# EAGLE design first schematic (EAGLE 7.6.0)
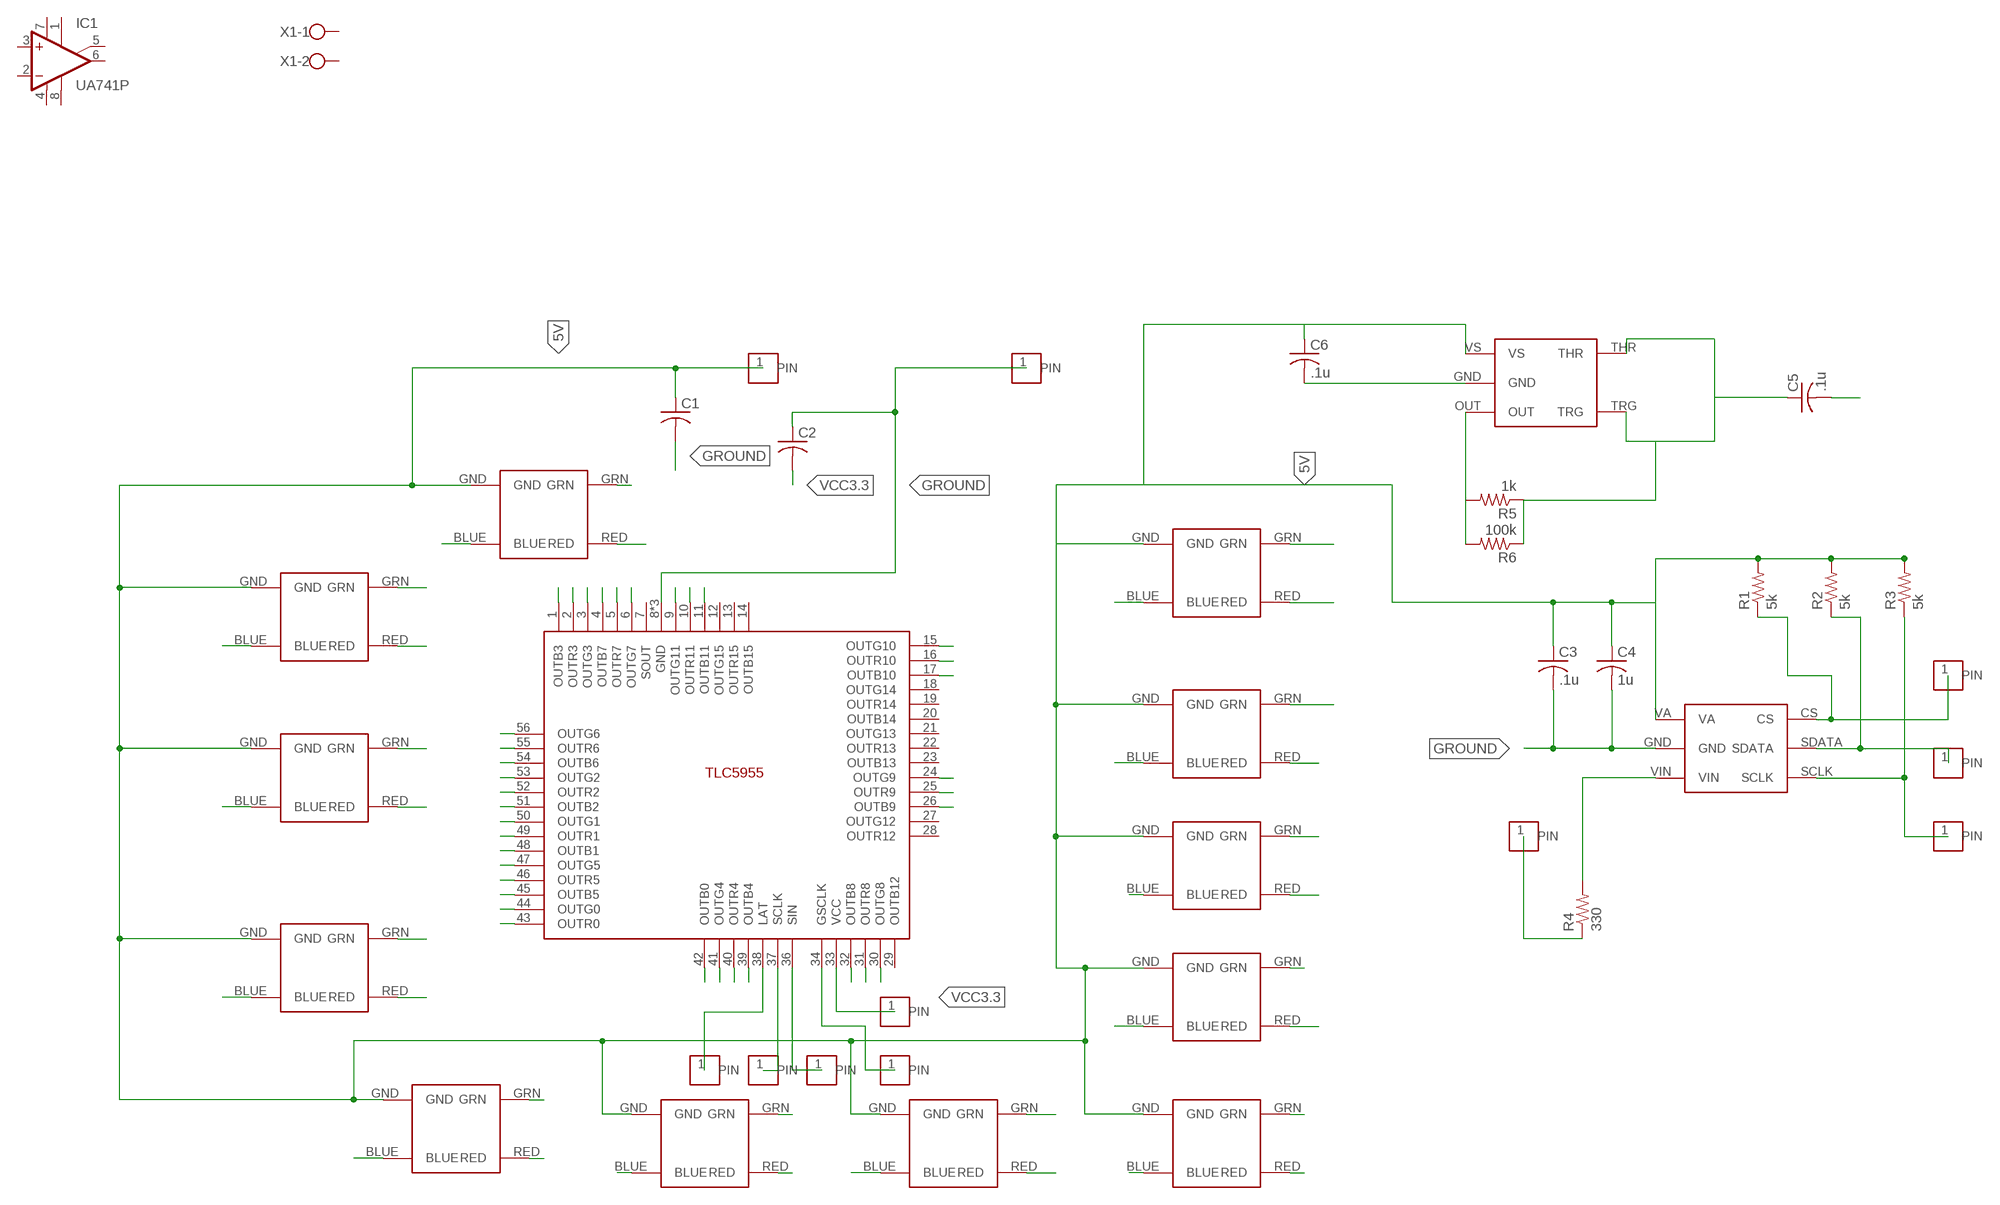
[diagram p0: schematic, sheet 1]

## Parts
3.3V  HEADERPIN_1  [HEADERPIN_1]
5V  HEADERPIN_1  [HEADERPIN_1]
C1  C-USC0805  [C0805]
C2  C-USC0805  [C0805]
C3  .1u  C-USC0805  [C0805]
C4  1u  C-USC0805  [C0805]
C5  .1u  C-USC0805  [C0805]
C6  .1u  C-USC0805  [C0805]
CS  HEADERPIN_1  [HEADERPIN_1]
GRND  HEADERPIN_1  [HEADERPIN_1]
GSCLK  HEADERPIN_1  [HEADERPIN_1]
IC1  UA741P  [DIL08]
LAT  HEADERPIN_1  [HEADERPIN_1]
R1  5k  R-US_M0805  [M0805]
R2  5k  R-US_M0805  [M0805]
R3  5k  R-US_M0805  [M0805]
R4  330  R-US_M0805  [M0805]
R5  1k  R-US_M0805  [M0805]
R6  100k  R-US_M0805  [M0805]
SCLK  HEADERPIN_1  [HEADERPIN_1]
SIN  HEADERPIN_1  [HEADERPIN_1]
SLK  HEADERPIN_1  [HEADERPIN_1]
TLC5955  TLC5954  [TLC5955]
TRG2  HEADERPIN_1  [HEADERPIN_1]
U$1  MIC1555  [SOT-23]
U$2  KINGSBRIGHT_LED_3.5X2.8  [KINGSBRIGHT_LED_3.5X2.8]
U$3  KINGSBRIGHT_LED_3.5X2.8  [KINGSBRIGHT_LED_3.5X2.8]
U$4  KINGSBRIGHT_LED_3.5X2.8  [KINGSBRIGHT_LED_3.5X2.8]
U$5  KINGSBRIGHT_LED_3.5X2.8  [KINGSBRIGHT_LED_3.5X2.8]
U$6  KINGSBRIGHT_LED_3.5X2.8  [KINGSBRIGHT_LED_3.5X2.8]
U$7  KINGSBRIGHT_LED_3.5X2.8  [KINGSBRIGHT_LED_3.5X2.8]
U$8  KINGSBRIGHT_LED_3.5X2.8  [KINGSBRIGHT_LED_3.5X2.8]
U$9  KINGSBRIGHT_LED_3.5X2.8  [KINGSBRIGHT_LED_3.5X2.8]
U$10  KINGSBRIGHT_LED_3.5X2.8  [KINGSBRIGHT_LED_3.5X2.8]
U$11  KINGSBRIGHT_LED_3.5X2.8  [KINGSBRIGHT_LED_3.5X2.8]
U$12  KINGSBRIGHT_LED_3.5X2.8  [KINGSBRIGHT_LED_3.5X2.8]
U$13  KINGSBRIGHT_LED_3.5X2.8  [KINGSBRIGHT_LED_3.5X2.8]
U$14  ADC121S101  [SOT-23(6)]
VIN  HEADERPIN_1  [HEADERPIN_1]
X1  W237-102  [W237-102]

## Nets
5V: 5V.1(PIN) C1.1 C3.1 C4.1 C6.1 R1.2 R2.2 R3.2 U$1.VS U$2.GND U$3.GND U$4.GND U$5.GND U$6.GND U$7.GND U$8.GND U$9.GND U$10.GND U$11.GND U$12.GND U$13.GND U$14.VA
B0: TLC5955.42(OUTB0) U$13.BLUE
B1: TLC5955.48(OUTB1) U$12.BLUE
B2: TLC5955.51(OUTB2) U$11.BLUE
B3: TLC5955.1(OUTB3) U$10.BLUE
B4: TLC5955.39(OUTB4) U$9.BLUE
B5: TLC5955.45(OUTB5) U$8.BLUE
B6: TLC5955.54(OUTB6) U$7.BLUE
B7: TLC5955.4(OUTB7) U$6.BLUE
B8: TLC5955.32(OUTB8) U$5.BLUE
B9: TLC5955.26(OUTB9) U$4.BLUE
B10: TLC5955.17(OUTB10) U$3.BLUE
B11: TLC5955.11(OUTB11) U$2.BLUE
G0: TLC5955.44(OUTG0) U$13.GRN
G1: TLC5955.50(OUTG1) U$12.GRN
G2: TLC5955.53(OUTG2) U$11.GRN
G3: TLC5955.3(OUTG3) U$10.GRN
G4: TLC5955.41(OUTG4) U$9.GRN
G5: TLC5955.47(OUTG5) U$8.GRN
G6: TLC5955.56(OUTG6) U$7.GRN
G7: TLC5955.6(OUTG7) U$6.GRN
G8: TLC5955.30(OUTG8) U$5.GRN
G9: TLC5955.24(OUTG9) U$4.GRN
G10: TLC5955.15(OUTG10) U$3.GRN
G11: TLC5955.9(OUTG11) U$2.GRN
GROUND: C1.2 C2.1 C3.2 C4.2 C5.2 C6.2 GRND.1(PIN) TLC5955.8(GND) TLC5955.35(GND) TLC5955.HEATSINK(GND) U$1.GND U$14.GND
GSCLK: GSCLK.1(PIN) R5.2 R6.2 TLC5955.34(GSCLK) U$1.OUT
LAT: LAT.1(PIN) TLC5955.38(LAT)
N$1: CS.1(PIN) R1.1 U$14.CS
N$2: R4.1 VIN.1(PIN)
N$3: R3.1 SLK.1(PIN) U$14.SCLK
N$6: R4.2 U$14.VIN
R0: TLC5955.43(OUTR0) U$13.RED
R1: TLC5955.49(OUTR1) U$12.RED
R2: TLC5955.52(OUTR2) U$11.RED
R3: TLC5955.2(OUTR3) U$10.RED
R4: TLC5955.40(OUTR4) U$9.RED
R5: TLC5955.46(OUTR5) U$8.RED
R6: TLC5955.55(OUTR6) U$7.RED
R7: TLC5955.5(OUTR7) U$6.RED
R8: TLC5955.31(OUTR8) U$5.RED
R9: TLC5955.25(OUTR9) U$4.RED
R10: TLC5955.16(OUTR10) U$3.RED
R11: TLC5955.10(OUTR11) U$2.RED
SCLK: SCLK.1(PIN) TLC5955.37(SCLK)
SDATA: R2.1 TRG2.1(PIN) U$14.SDATA
SIN: SIN.1(PIN) TLC5955.36(SIN)
THR: C5.1 R5.1 R6.1 U$1.THR U$1.TRG
VCC3.3: 3.3V.1(PIN) C2.2 TLC5955.33(VCC)
Unconnected: IC1.1(ON1) IC1.2(-IN) IC1.3(+IN) IC1.5(ON2) IC1.6(OUT) IC1.8(OPT) TLC5955.7(SOUT) TLC5955.12(OUTG15) TLC5955.13(OUTR15) TLC5955.14(OUTB15) TLC5955.18(OUTG14) TLC5955.19(OUTR14) TLC5955.20(OUTB14) TLC5955.21(OUTG13) TLC5955.22(OUTR13) TLC5955.23(OUTB13) TLC5955.27(OUTG12) TLC5955.28(OUTR12) TLC5955.29(OUTB12) X1.1 X1.2

## Power pins joined to a net without a drawn wire
V+: IC1.7(V+)
V-: IC1.4(V-)

## Library data of the parts
3.3V 5V CS GRND GSCLK LAT SCLK SIN SLK TRG2 VIN = HEADERPIN_1:HEADERPIN_1
C1-C6 = rcl:C-US: CAPACITOR, American symbol
IC1 = linear:*741: OP AMP
R1-R6 = resistor:R-US_: RESISTOR, American symbol
TLC5955 = TLC5955:TLC5954
U$1 = TLC5955:MIC1555
U$2-U$13 = KINGSBRIGHT_LED_3.5X2.8:KINGSBRIGHT_LED_3.5X2.8
U$14 = TLC5955:ADC121S101
X1 = con-wago-500:W237-102: WAGO SCREW CLAMP; MPN: 237-102; OC_FARNELL: unknown; OC_NEWARK: 70K9898

## Board
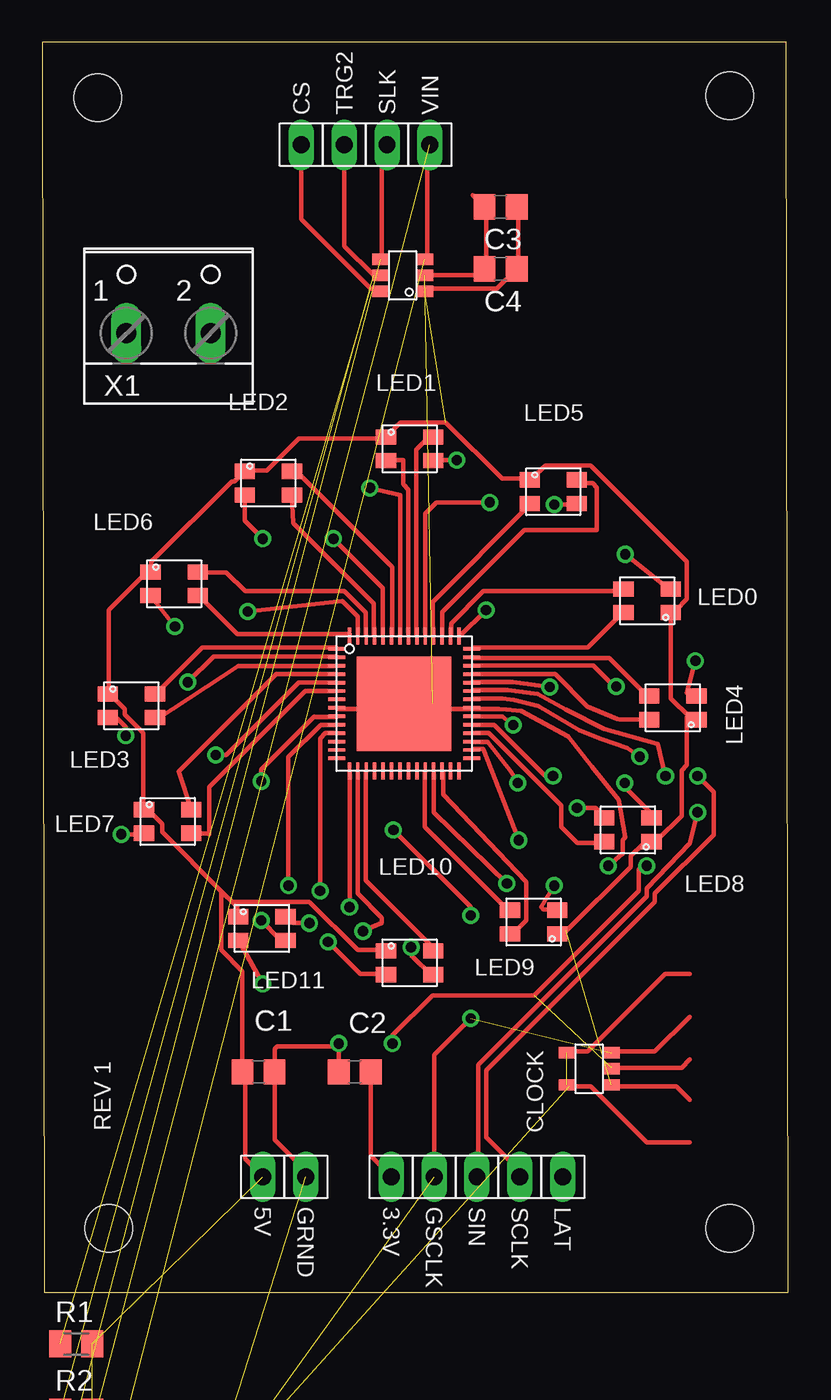
[diagram p1: board, top side]
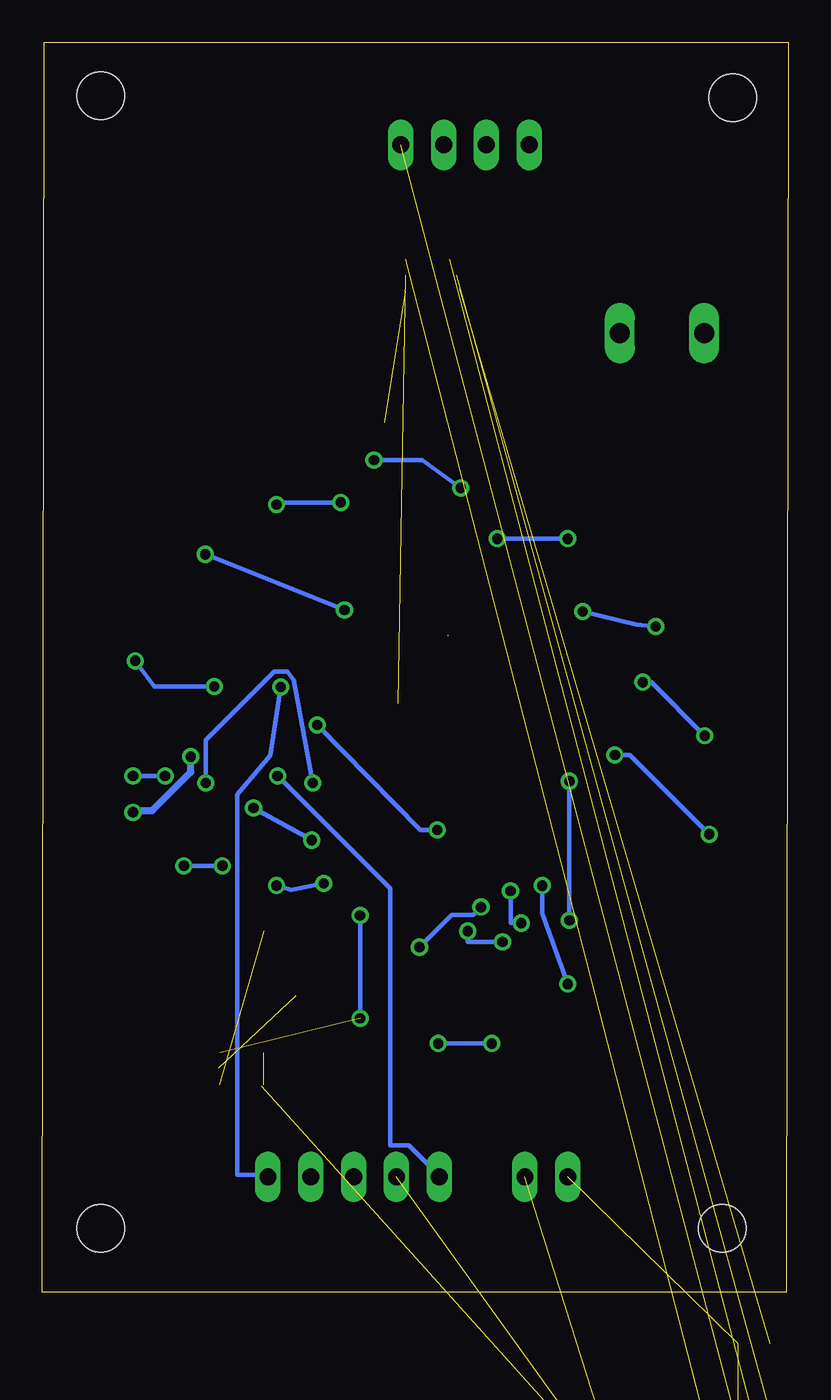
[diagram p2: board, bottom side, seen from below]

Size 44.25 x 74.16 mm. Coordinates in mm from the lower left corner, seen from the top.
Outline: 0.13,0 44.25,0 44.12,74.16 0,74.16 0.13,0
Copper layers (1*16): Top 0.035mm / dielectric 1.5mm / Bottom 0.035mm
Design rules "default": minimum track width 10mil, minimum drill 24mil, track to track 8mil, track to pad 8mil, pad to pad 8mil, via to via 8mil, smd to smd 8mil, copper to edge 40mil, drill to drill 8mil, minimum pad ring 10mil, minimum via ring 8mil, stop-mask expansion 4mil, vias tented up to drill 0mil, thermal gap 10mil
Holes 2.8 mm at 3.3,70.87 3.94,3.81 40.77,3.81 40.77,70.99

### Footprints (pad centres in the part's own frame; a part is rotated, then mirrored left to right if it is on the bottom)
HEADERPIN_1 = drill 1 long: 1 0,0
C0805 = smd 1.3 x 1.5: 1 -0.95,0; 2 0.95,0
DIL08 = drill 0.813 pad 1.27: 1 -3.81,-3.81; 2 -1.27,-3.81; 3 1.27,-3.81; 4 3.81,-3.81; 5 3.81,3.81; 6 1.27,3.81; 7 -1.27,3.81; 8 -3.81,3.81
M0805 = smd 1.3 x 1.6: 1 -0.95,0; 2 0.95,0
TLC5955 = smd 1.016 x 0.203: 1 -4,3.25; 2 -4,2.75; 3 -4,2.25; 4 -4,1.75; 5 -4,1.25; 6 -4,0.75; 7 -4,0.25; 8 -4,-0.25; 9 -4,-0.75; 10 -4,-1.25; 11 -4,-1.75; 12 -4,-2.25; 13 -4,-2.75; 14 -4,-3.25; 29 4,-3.25; 30 4,-2.75; 31 4,-2.25; 32 4,-1.75; 33 4,-1.25; 34 4,-0.75; 35 4,-0.25; 36 4,0.25; 37 4,0.75; 38 4,1.25; 39 4,1.75; 40 4,2.25; 41 4,2.75; 42 4,3.25 | smd 0.203 x 1.016: 15 -3.25,-4; 16 -2.75,-4; 17 -2.25,-4; 18 -1.75,-4; 19 -1.25,-4; 20 -0.75,-4; 21 -0.25,-4; 22 0.25,-4; 23 0.75,-4; 24 1.25,-4; 25 1.75,-4; 26 2.25,-4; 27 2.75,-4; 28 3.25,-4; 43 3.25,4; 44 2.75,4; 45 2.25,4; 46 1.75,4; 47 1.25,4; 48 0.75,4; 49 0.25,4; 50 -0.25,4; 51 -0.75,4; 52 -1.25,4; 53 -1.75,4; 54 -2.25,4; 55 -2.75,4; 56 -3.25,4 | smd 5.6 x 5.6: HEATSINK 0,0
SOT-23 = smd 1 x 0.66: GND -2.107,0.95; OUT -2.107,0; THR 0.507,1.9; TRG 0.507,0; VS -2.107,1.9
KINGSBRIGHT_LED_3.5X2.8 = smd 1.2 x 0.9: BLUE 3,-0.7; GND 0.2,-0.7; GRN 3,-2.1; RED 0.2,-2.1
SOT-23(6) = smd 1 x 0.66: CS 0.507,0.95; GND -2.107,0; SCLK 0.507,-0.95; SDATA 0.507,0; VA -2.107,0.95; VIN -2.107,-0.95
W237-102 = drill 1.194 long: 1 -2.5,-1.27; 2 2.5,-1.27

### Placement (x,y rotation side)
3.3V  20.7,6.86 0 top
5V  13.08,6.86 0 top
C1  12.83,13.08 0 top
C2  18.54,13.08 0 top
C3  27.18,64.39 180 top
C4  27.18,60.71 180 top
C5  2.03,-33.53 0 top  (outside the outline)
C6  2.03,-39.62 0 top  (outside the outline)
CS  15.37,68.07 180 top
GRND  15.62,6.86 0 top
GSCLK  23.24,6.86 0 top
IC1  7.11,-47.62 0 top  (outside the outline)
LAT  30.86,6.86 0 top
R1  2.03,-3.05 0 top  (outside the outline)
R2  2.03,-7.11 0 top  (outside the outline)
R3  2.03,-11.18 0 top  (outside the outline)
R4  2.03,-15.24 0 top  (outside the outline)
R5  2.03,-21.34 0 top  (outside the outline)
R6  2.03,-27.43 0 top  (outside the outline)
SCLK  28.32,6.86 0 top
SIN  25.78,6.86 0 top
SLK  20.45,68.07 180 top
TLC5955  21.46,34.92 0 top
TRG2  17.91,68.07 180 top
U$1  31.62,14.22 180 top
U$2  11.43,22.99 0 top
U$3  20.19,20.95 0 top
U$4  30.73,20.57 180 top
U$5  36.32,26.04 180 top
U$6  5.84,29.34 0 top
U$7  6.22,43.43 0 top
U$8  28.7,48.9 0 top
U$9  38.99,33.27 180 top
U$10  3.68,36.2 0 top
U$11  11.81,49.4 0 top
U$12  20.19,51.44 0 top
U$13  37.47,39.62 180 top
U$14  20.57,60.33 180 top
VIN  22.99,68.07 180 top
X1  7.49,58.17 0 top

### Tracks (layer width: path | path; a pad name or v marks a point on that pad's centre or on a via)
5V  (6 unrouted)
  Top 0.254: 38.39,11.43 37.59,12.22 33.78,12.22 U$1.VS | U$4.GND 30.61,21.43 31.08,21.43 34.89,25.24 34.89,25.88 35.69,26.67 36,26.67 U$5.GND 36.16,26.83 36.48,26.83 37.91,28.26 37.91,30.96 38.23,31.27 38.23,34.13 U$9.GND 38.7,34.13 38.39,34.13 37.28,35.24 U$13.GND 37.28,40.48 37.59,40.48 38.23,41.12 38.23,43.34 32.51,49.05 29.81,49.05 29.02,48.26 U$8.GND 28.86,48.26 27.27,48.26 23.94,51.59 21.24,51.59 20.45,50.8 U$12.GND 20.29,50.64 15.21,50.64 13.3,48.74 12.03,48.74 U$11.GND 11.88,48.58 11.4,48.1 11.24,48.1 6.48,43.34 6.48,42.86 U$7.GND 6.32,42.86 3.94,40.48 3.94,35.56 | 5V.1 12.99,6.99 12.03,7.94 12.03,13.02 C1.1 11.88,13.18 11.88,19.05 10.6,20.32 10.6,23.65 10.68,23.73 | 3.94,35.56 4.89,34.61 4.89,34.29 6,33.18 6,28.73 U$6.GND 6.16,28.73 7.11,27.78 7.11,27.3 10.68,23.73 | 3.94,35.56 U$10.GND | 10.68,23.73 11.32,23.1 | 11.32,23.1 11.56,22.86 11.56,22.38 U$2.GND | U$3.GND 20.29,20.32 18.7,20.32 15.84,23.18 11.4,23.18 11.32,23.1 | U$14.VA 22.83,59.53 26.96,59.53 28.07,60.64 C4.1 28.23,60.8 28.23,64.29 C3.1 28.07,64.45
B0
  Top 0.254: TLC5955.42 25.53,38.26 32.35,38.26 34.42,40.32 U$13.BLUE
B1
  Top 0.254: TLC5955.48 22.19,39.05 22.19,50.01 22.83,50.64 23.15,50.64 U$12.BLUE
B2
  Top 0.254: TLC5955.51 20.76,39.05 20.76,43.02 15.21,48.58 14.89,48.58 U$11.BLUE
B3
  Top 0.254: TLC5955.1 17.43,38.26 9.49,38.26 6.79,35.56 U$10.BLUE
B4
  Top 0.254: TLC5955.39 25.53,36.67 30.42,36.67 32.32,34.77 34.1,34 34.26,33.97 35.85,33.97 U$9.BLUE
B5
  Top 0.254: U$8.BLUE 31.89,48.01 32.64,48.01 32.89,47.75 32.89,45.21 28.57,45.21 23.71,40.35 TLC5955.45
B6
  Top 0.254: TLC5955.54 19.18,39.05 19.18,40.32 17.91,41.59 12.03,41.59 10.92,42.7 9.33,42.7 U$7.BLUE
B7
  Top 0.254: TLC5955.4 17.43,36.67 16.89,36.67 16.8,36.67 13.88,36.67 8.1,30.89 U$6.BLUE
B8
  Top 0.254: TLC5955.32 25.53,33.18 26.48,33.18 30.77,28.89 30.77,27.62 31.72,26.67 33.31,26.67 U$5.BLUE
B9
  Top 0.254: TLC5955.26 23.78,30.8 23.78,29.53 28.7,24.35 28.7,22.07 28.07,21.43 27.75,21.43 U$4.BLUE
B10
  Top 0.254: TLC5955.17 19.18,30.8 19.18,24.45 23.3,20.32 U$3.BLUE
B11  (via drill 0.61)
  Top 0.254: v16.48,23.81 16.48,32.86 16.8,33.18 17.43,33.18 TLC5955.11 | v15.84,21.91 14.89,21.91 14.57,22.23 U$2.BLUE
  Bottom 0.254: v16.48,23.81 16.48,21.91 v15.84,21.91
G0
  Top 0.254: TLC5955.44 24.26,39.05 24.26,39.69 26.16,41.59 34.42,41.59 U$13.GRN
G1  (via drill 0.61)
  Top 0.254: v19.43,47.72 21.24,47.31 21.24,39.05 TLC5955.50 | v24.57,49.37 23.3,49.37 U$12.GRN
  Bottom 0.254: v19.43,47.72 21.72,49.37 v24.57,49.37
G2
  Top 0.254: TLC5955.53 19.65,39.05 19.65,40.86 14.89,45.62 U$11.GRN
G3
  Top 0.254: TLC5955.3 17.43,37.15 11.62,37.15 6.79,33.97 U$10.GRN
G4
  Top 0.254: TLC5955.41 25.53,37.62 33.62,37.62 35.85,35.4 U$9.GRN
G5  (via drill 0.6)
  Top 0.254: v26.54,46.86 23.37,46.86 22.71,46.21 TLC5955.47 | v30.35,46.74 31.62,46.74 U$8.GRN
  Bottom 0.254: v26.54,46.86 30.1,46.86 v30.35,46.74
G6
  Top 0.254: TLC5955.56 18.22,39.05 11.56,39.05 9.33,41.27 U$7.GRN
G7
  Top 0.254: TLC5955.6 15.61,35.67 9.91,29.97 9.91,27.18 9.85,27.24 U$6.GRN
G8  (via drill 0.61)
  Top 0.254: v28.26,26.83 26.16,32.23 25.53,32.23 TLC5955.30 | v31.72,28.73 32.83,28.73 33.31,28.26 U$5.GRN
  Bottom 0.254: v31.72,28.73 v28.26,26.83
G9
  Top 0.254: TLC5955.24 22.67,30.8 22.67,27.62 27.59,22.7 U$4.GRN
G10  (via drill 0.61)
  Top 0.254: v18.22,22.86 18.22,30.8 TLC5955.15 | v21.88,20.48 21.88,20 23.15,18.73 U$3.GRN
  Bottom 0.254: v18.22,22.86 18.7,22.38 19.97,22.38 v21.88,20.48
G11  (via drill 0.61)
  Top 0.254: v12.99,22.07 14.1,20.95 14.41,20.95 U$2.GRN | TLC5955.9 17.43,34.13 16.89,34.13 16.8,34.13 16.16,34.13 16.13,34.16 12.99,31.02 v12.99,30.32
  Bottom 0.254: v12.99,22.07 v12.99,30.32
GROUND  (via drill 0.61)  (4 unrouted)
  Top 0.254: 17.51,14.53 17.59,14.45 17.59,13.18 C2.1 | 17.51,14.53 17.43,14.61 13.94,14.61 13.78,14.45 13.78,13.18 C1.2 13.78,13.02 13.78,9.05 15.53,7.3 15.53,6.99 GRND.1 | TLC5955.8 17.59,34.61 19.49,34.61 19.81,34.92 TLC5955.HEATSINK 23.15,34.92 23.46,34.61 25.37,34.61 TLC5955.35 25.53,34.61 27.11,34.61 27.53,34.58 28.42,34.48 31.18,32.99 32.58,31.21 34.2,29.21 34.58,26.99 34.42,26.83 34.42,26.04 v33.56,25.3 | v17.59,14.76 17.59,14.61 17.51,14.53 | v20.76,14.76 20.76,15.24 23.15,17.62 29.18,17.62 35.37,23.81 35.37,25.08 v35.85,25.3 | 38.39,13.81 37.91,13.34 33.78,13.34 U$1.GND | U$14.GND 25.84,60.33 26.16,60.64 C4.2 26.32,60.8 26.32,64.29 C3.2 26.16,64.45 25.53,65.09
  Bottom 0.254: v20.76,14.76 v17.59,14.76 | v33.56,25.3 v35.85,25.3
GSCLK  (via drill 0.6)  (3 unrouted)
  Top 0.254: GSCLK.1 23.24,14.1 v25.4,16.26 | v25.4,22.35 25.4,22.86 v20.83,27.43 | v27.94,33.66 27.29,34.17 TLC5955.34 | 38.39,16.35 36.32,14.29 33.78,14.29 U$1.OUT
  Bottom 0.254: v25.4,16.26 v25.4,22.35 | v20.83,27.43 21.84,27.43 v27.94,33.66
LAT  (via drill 0.61)
  Top 0.254: v30.1,35.91 27.91,36.2 25.53,36.2 TLC5955.38
  Bottom 0.254: v30.1,35.91 30.73,31.84 32.67,29.53 32.67,6.99 30.92,6.99 LAT.1
N$1  (1 unrouted)
  Top 0.254: CS.1 15.37,63.66 19.49,59.53 19.97,59.53 U$14.CS
N$2  (1 unrouted)
N$3  (1 unrouted)
  Top 0.254: U$14.SCLK 20.13,61.28 20.13,67.63 20.45,67.94 SLK.1
N$6  (1 unrouted)
  Top 0.254: 22.99,67.94 22.83,67.79 22.83,61.28 U$14.VIN
R0  (via drill 0.61)
  Top 0.254: v26.32,40.48 24.73,38.89 TLC5955.43 | v34.58,43.78 37.12,41.75 U$13.RED
  Bottom 0.254: v34.58,43.78 v26.32,40.48
R1
  Top 0.254: TLC5955.49 21.72,39.05 21.72,47.62 21.4,47.94 21.4,49.37 20.45,49.37 U$12.RED
R2  (via drill 0.6)  (1 unrouted)
  Top 0.254: U$11.RED 12.01,45.77 v13.08,44.7 | v17.27,44.7 20.19,41.78 20.19,38.99
  Bottom 0.254: v13.08,44.7 v17.27,44.7
R3  (via drill 0.6)
  Top 0.254: v8.64,36.2 10.16,37.72 17.42,37.72 TLC5955.2 | v4.95,33.02 4.95,33.53 4.44,34.04 3.94,34.04 U$10.RED
  Bottom 0.254: v8.64,36.2 8.13,36.2 v4.95,33.02
R4  (via drill 0.6)
  Top 0.254: v34.04,35.94 33.91,35.94 32.68,37.17 TLC5955.40 | v38.73,37.47 38.23,35.56 38.35,35.43 38.73,35.43 U$9.RED
  Bottom 0.254: v34.04,35.94 37.59,35.94 v38.73,37.47
R5
  Top 0.254: TLC5955.46 23.15,39.05 23.15,40.96 28.86,46.67 U$8.RED
R6  (via drill 0.6)
  Top 0.254: v12.19,40.39 17.78,41.02 18.71,40.09 TLC5955.55 | v7.87,39.5 6.48,41.27 U$7.RED
  Bottom 0.254: v12.19,40.39 9.02,39.62 v7.87,39.5
R7  (via drill 0.6)
  Top 0.254: v10.29,31.88 10.92,31.88 15.22,36.17 TLC5955.5 | v4.7,27.18 5.97,27.18 U$6.RED
  Bottom 0.254: v10.29,31.88 9.4,31.88 v4.7,27.18
R8  (via drill 0.6)
  Top 0.254: 27.94,30.23 v28.19,30.23 27.81,30.86 26.42,32.64 25.5,32.64 TLC5955.31 | v34.54,30.23 34.54,29.97 36.32,28.19 36.2,28.07 U$5.RED
  Bottom 0.254: v28.19,30.23 29.34,36.32 29.72,36.83 30.48,36.83 34.54,32.77 v34.54,30.23
R9  (via drill 0.6)
  Top 0.254: v27.56,24.26 23.21,28.48 TLC5955.25 | v30.35,24.13 29.59,22.86 29.72,22.73 30.48,22.73 U$4.RED
  Bottom 0.254: v27.56,24.26 29.46,23.88 v30.35,24.13
R10  (via drill 0.61)
  Top 0.254: v19.02,21.43 20.13,21.91 20.13,22.23 18.7,23.65 18.7,30.8 TLC5955.16 | v16.95,20.8 18.86,18.89 20.29,18.89 U$3.RED
  Bottom 0.254: v19.02,21.43 19.02,20.8 v16.95,20.8
R11  (via drill 0.6)
  Top 0.254: v13.08,18.29 11.68,20.83 U$2.RED | v14.61,24.13 14.61,31.75 16.51,33.66 17.44,33.66 TLC5955.10
  Bottom 0.254: v14.61,24.13 14.61,22.48 v13.08,18.29
SCLK  (via drill 0.61)
  Top 0.254: v36.96,30.64 36.51,32.54 33.34,33.43 31.05,34.58 29.37,35.5 27.59,35.72 25.53,35.72 TLC5955.37 | v38.86,30.64 39.82,29.69 39.82,27.15 36.32,23.65 36.32,23.18 26.32,13.18 26.32,9.21 28.23,7.3 28.23,6.99 SCLK.1
  Bottom 0.254: v38.86,30.64 v36.96,30.64
SDATA  (1 unrouted)
  Top 0.254: U$14.SDATA 19.65,60.33 17.91,62.07 TRG2.1
SIN  (via drill 0.61)
  Top 0.254: v35.43,31.78 34.7,32.29 33.15,32.83 31.88,33.34 29.4,34.8 28,35.15 27.27,35.24 25.53,35.24 TLC5955.36 | v38.86,28.48 38.89,28.64 38.39,26.64 35.85,23.97 35.85,23.5 25.84,13.49 25.84,6.99 SIN.1
  Bottom 0.406: v35.43,31.78 35.43,30.86 37.72,28.57 38.86,28.57 v38.86,28.48
THR  (4 unrouted)
  Top 0.254: 38.39,8.89 35.85,8.89 32.51,12.22 31.24,12.22 U$1.THR | 38.39,18.89 36.96,18.89 32.35,14.29 31.24,14.29 U$1.TRG
VCC3.3  (via drill 0.61)
  Top 0.254: v30.29,30.64 29.81,30.64 26.8,33.66 25.53,33.66 TLC5955.33 | C2.2 19.49,13.02 19.49,8.1 20.61,6.99 3.3V.1
  Bottom 0.254: v30.29,30.64 23.62,23.97 23.62,8.73 22.51,8.73 20.76,6.99 3.3V.1

### Text on the board
tPlace: LED1 | LED2 | LED5 | LED6 | LED0 | LED4 | LED3 | LED7 | LED10 | LED8 | LED11 | LED9 | REV 1 | CLOCK